# Altium project RFID_DACS-01.PrjPcb (part 1 of 3)
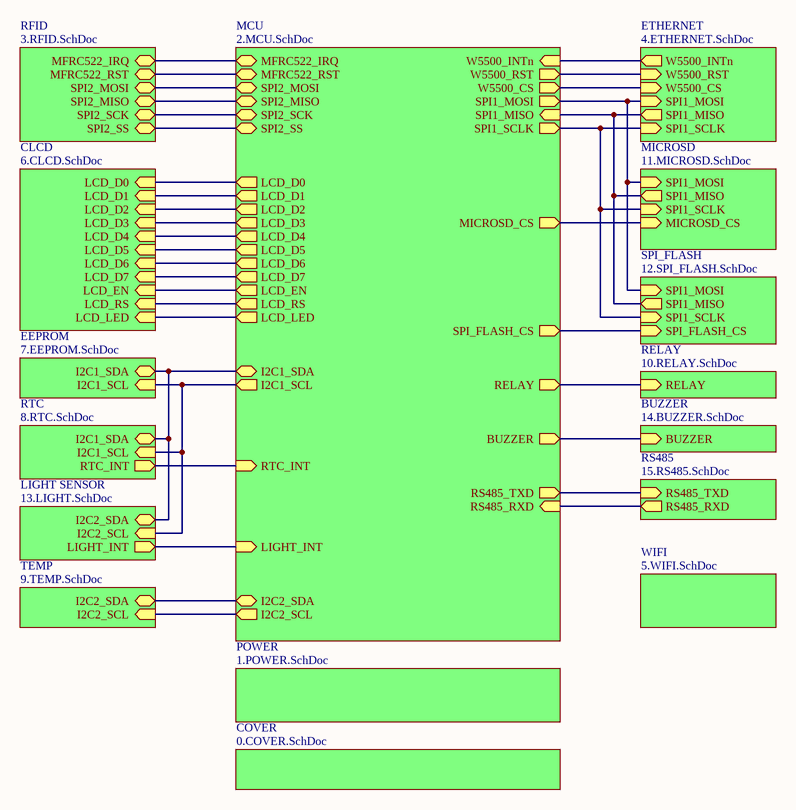
[diagram p0: RFID_DACS-01.SchDoc]
DesignedBy: AYTAC DILEK; Project: RFID_DACS-01; RevisionNumber: V1.0; TotalSheetNumber: 16; VersionRevision: V1I0
17 sheets, 190 parts. Net scope: hierarchical (ports join the sheet entries above them; power ports are global).
Board file: RFID_DACS-01.PcbDoc
Sheets:
  RFID_DACS-01.SchDoc
    MCU = 2.MCU.SchDoc
    ETHERNET = 4.ETHERNET.SchDoc
    RFID = 3.RFID.SchDoc
    MICROSD = 11.MICROSD.SchDoc
    SPI_FLASH = 12.SPI_FLASH.SchDoc
    CLCD = 6.CLCD.SchDoc
    EEPROM = 7.EEPROM.SchDoc
    RTC = 8.RTC.SchDoc
    TEMP = 9.TEMP.SchDoc
    POWER = 1.POWER.SchDoc
    RELAY = 10.RELAY.SchDoc
    BUZZER = 14.BUZZER.SchDoc
    RS485 = 15.RS485.SchDoc
    WIFI = 5.WIFI.SchDoc
    COVER = 0.COVER.SchDoc
    LIGHT SENSOR = 13.LIGHT.SchDoc

## Sheet RFID_DACS-01.SchDoc: BLOCK DIAGRAM
size A; DrawnBy: AYTAC DILEK

### Sub-sheets
BUZZER = 14.BUZZER.SchDoc: BUZZER (in)
CLCD = 6.CLCD.SchDoc: LCD_D0 (in), LCD_D1 (in), LCD_D2 (in), LCD_D3 (in), LCD_D5 (in), LCD_D4 (in), LCD_D6 (in), LCD_D7 (in), LCD_EN (in), LCD_RS (in), LCD_LED (in)
COVER = 0.COVER.SchDoc: no entries
EEPROM = 7.EEPROM.SchDoc: I2C1_SDA (bidir), I2C1_SCL (in)
ETHERNET = 4.ETHERNET.SchDoc: W5500_INTn (out), W5500_RST (in), W5500_CS (in), SPI1_MOSI (in), SPI1_MISO (out), SPI1_SCLK (in)
LIGHT SENSOR = 13.LIGHT.SchDoc: I2C2_SDA (bidir), I2C2_SCL (in), LIGHT_INT (out)
MCU = 2.MCU.SchDoc: W5500_INTn (in), W5500_RST (out), W5500_CS (out), SPI1_MOSI (out), SPI1_MISO (in), SPI1_SCLK (out), MFRC522_IRQ, MFRC522_RST, SPI2_MOSI, SPI2_MISO, SPI2_SCK, SPI2_SS, MICROSD_CS (out), SPI_FLASH_CS (out), LCD_D1 (out), LCD_D2 (out), LCD_D3 (out), LCD_D4 (out), LCD_D5 (out), LCD_D6 (out), LCD_D0 (out), LCD_D7 (out), LCD_EN (out), LCD_RS (out), LCD_LED (out), I2C1_SDA (bidir), I2C1_SCL (out), RTC_INT (in), I2C2_SDA (bidir), I2C2_SCL (out), RELAY (out), BUZZER (out), RS485_TXD (out), RS485_RXD (in), LIGHT_INT (in)
MICROSD = 11.MICROSD.SchDoc: SPI1_MOSI (in), SPI1_MISO (out), SPI1_SCLK (in), MICROSD_CS (in)
POWER = 1.POWER.SchDoc: no entries
RELAY = 10.RELAY.SchDoc: RELAY (in)
RFID = 3.RFID.SchDoc: MFRC522_IRQ, MFRC522_RST, SPI2_MOSI, SPI2_MISO, SPI2_SCK, SPI2_SS
RS485 = 15.RS485.SchDoc: RS485_TXD (in), RS485_RXD (out)
RTC = 8.RTC.SchDoc: I2C1_SDA (bidir), I2C1_SCL (in), RTC_INT (out)
SPI_FLASH = 12.SPI_FLASH.SchDoc: SPI1_MOSI (in), SPI1_MISO (out), SPI1_SCLK (in), SPI_FLASH_CS (in)
TEMP = 9.TEMP.SchDoc: I2C2_SDA (bidir), I2C2_SCL (in)
WIFI = 5.WIFI.SchDoc: no entries

### Nets
BUZZER: sheet MCU/BUZZER, sheet BUZZER/BUZZER
I2C1_SCL: sheet MCU/I2C1_SCL, sheet EEPROM/I2C1_SCL, sheet RTC/I2C1_SCL, sheet LIGHT SENSOR/I2C2_SCL
I2C1_SDA: sheet MCU/I2C1_SDA, sheet EEPROM/I2C1_SDA, sheet RTC/I2C1_SDA, sheet LIGHT SENSOR/I2C2_SDA
I2C2_SCL: sheet MCU/I2C2_SCL, sheet TEMP/I2C2_SCL
I2C2_SDA: sheet MCU/I2C2_SDA, sheet TEMP/I2C2_SDA
LCD_D0: sheet MCU/LCD_D0, sheet CLCD/LCD_D0
LCD_D1: sheet MCU/LCD_D1, sheet CLCD/LCD_D1
LCD_D2: sheet MCU/LCD_D2, sheet CLCD/LCD_D2
LCD_D3: sheet MCU/LCD_D3, sheet CLCD/LCD_D3
LCD_D4: sheet MCU/LCD_D4, sheet CLCD/LCD_D4
LCD_D5: sheet MCU/LCD_D5, sheet CLCD/LCD_D5
LCD_D6: sheet MCU/LCD_D6, sheet CLCD/LCD_D6
LCD_D7: sheet MCU/LCD_D7, sheet CLCD/LCD_D7
LCD_EN: sheet MCU/LCD_EN, sheet CLCD/LCD_EN
LCD_LED: sheet MCU/LCD_LED, sheet CLCD/LCD_LED
LCD_RS: sheet MCU/LCD_RS, sheet CLCD/LCD_RS
LIGHT_INT: sheet MCU/LIGHT_INT, sheet LIGHT SENSOR/LIGHT_INT
MFRC522_IRQ: sheet MCU/MFRC522_IRQ, sheet RFID/MFRC522_IRQ
MFRC522_RST: sheet MCU/MFRC522_RST, sheet RFID/MFRC522_RST
MICROSD_CS: sheet MCU/MICROSD_CS, sheet MICROSD/MICROSD_CS
RELAY: sheet MCU/RELAY, sheet RELAY/RELAY
RS485_RXD: sheet MCU/RS485_RXD, sheet RS485/RS485_RXD
RS485_TXD: sheet MCU/RS485_TXD, sheet RS485/RS485_TXD
RTC_INT: sheet MCU/RTC_INT, sheet RTC/RTC_INT
SPI1_MISO: sheet MCU/SPI1_MISO, sheet ETHERNET/SPI1_MISO, sheet MICROSD/SPI1_MISO, sheet SPI_FLASH/SPI1_MISO
SPI1_MOSI: sheet MCU/SPI1_MOSI, sheet ETHERNET/SPI1_MOSI, sheet MICROSD/SPI1_MOSI, sheet SPI_FLASH/SPI1_MOSI
SPI1_SCLK: sheet MCU/SPI1_SCLK, sheet ETHERNET/SPI1_SCLK, sheet MICROSD/SPI1_SCLK, sheet SPI_FLASH/SPI1_SCLK
SPI2_MISO: sheet MCU/SPI2_MISO, sheet RFID/SPI2_MISO
SPI2_MOSI: sheet MCU/SPI2_MOSI, sheet RFID/SPI2_MOSI
SPI2_SCK: sheet MCU/SPI2_SCK, sheet RFID/SPI2_SCK
SPI2_SS: sheet MCU/SPI2_SS, sheet RFID/SPI2_SS
SPI_FLASH_CS: sheet MCU/SPI_FLASH_CS, sheet SPI_FLASH/SPI_FLASH_CS
W5500_CS: sheet MCU/W5500_CS, sheet ETHERNET/W5500_CS
W5500_INTn: sheet MCU/W5500_INTn, sheet ETHERNET/W5500_INTn
W5500_RST: sheet MCU/W5500_RST, sheet ETHERNET/W5500_RST

## Sheet 2.MCU.SchDoc: MCU
size A3; DrawnBy: AYTAC DILEK; SheetNumber: 2; SheetTotal: 16
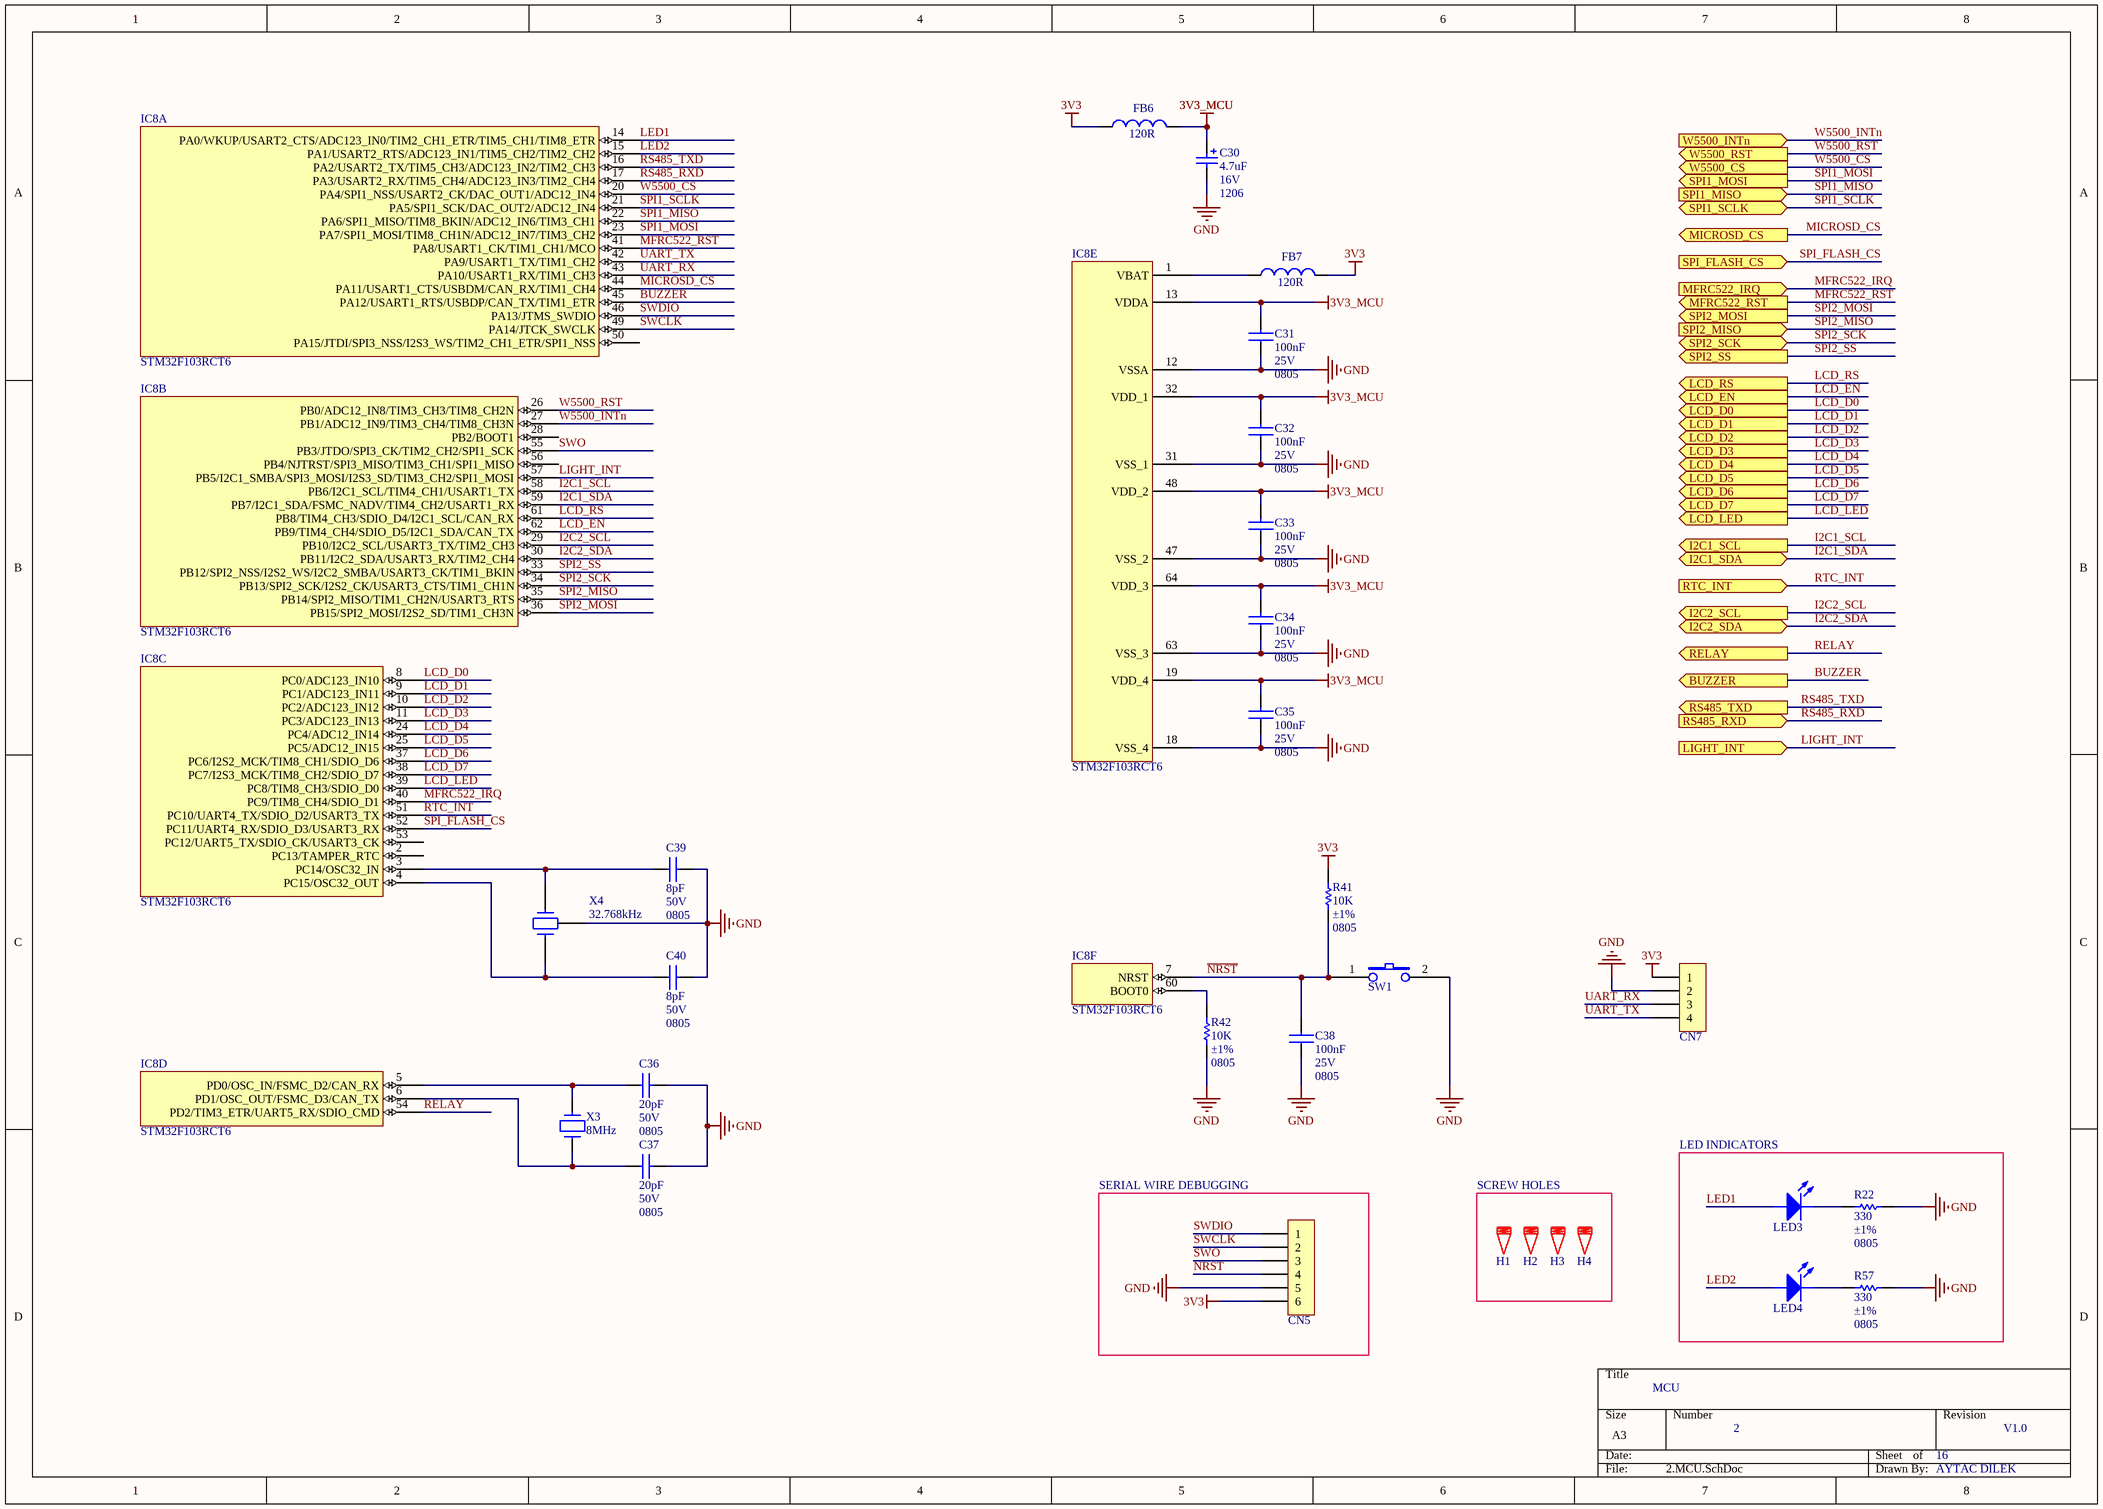
[diagram p1: 2.MCU.SchDoc]

### Parts
C30  value 4.7uF  Voltage - Rated: 16V  Package / Case: 1206  [CAPMP3216X16N_EIA-1206_CASE-A]  (hidden comment: CAP_P)
C31  Capacitance: 100nF  Voltage - Rated: 25V  Package / Case: 0805  [CAPC2012X100N_EIA0805]  (hidden comment: CAP_NP)
C32  Capacitance: 100nF  Voltage - Rated: 25V  Package / Case: 0805  [CAPC2012X100N_EIA0805]  (hidden comment: CAP_NP)
C33  Capacitance: 100nF  Voltage - Rated: 25V  Package / Case: 0805  [CAPC2012X100N_EIA0805]  (hidden comment: CAP_NP)
C34  Capacitance: 100nF  Voltage - Rated: 25V  Package / Case: 0805  [CAPC2012X100N_EIA0805]  (hidden comment: CAP_NP)
C35  Capacitance: 100nF  Voltage - Rated: 25V  Package / Case: 0805  [CAPC2012X100N_EIA0805]  (hidden comment: CAP_NP)
C36  Capacitance: 20pF  Voltage - Rated: 50V  Package / Case: 0805  [CAPC2012X100N_EIA0805]  (hidden comment: CAP_NP)
C37  Capacitance: 20pF  Voltage - Rated: 50V  Package / Case: 0805  [CAPC2012X100N_EIA0805]  (hidden comment: CAP_NP)
C38  Capacitance: 100nF  Voltage - Rated: 25V  Package / Case: 0805  [CAPC2012X100N_EIA0805]  (hidden comment: CAP_NP)
C39  Capacitance: 8pF  Voltage - Rated: 50V  Package / Case: 0805  [CAPC2012X100N_EIA0805]  (hidden comment: CAP_NP)
C40  Capacitance: 8pF  Voltage - Rated: 50V  Package / Case: 0805  [CAPC2012X100N_EIA0805]  (hidden comment: CAP_NP)
CN5  HDR_1X6  [HDRFV6W70P254_1X6_1524X254X1118P]  (value not drawn)
CN7  HDR_1X4  [HDRFV4W70P254_1X4_1016X254X1118P]  (value not drawn)
FB6  Impedance: 120R  [FILC2012X100N_EIA0805]  (hidden comment: BEAD)
FB7  Impedance: 120R  [FILC2012X100N_EIA0805]  (hidden comment: BEAD)
H1  HOLES  [HOLE_125MIL]  (value not drawn)
H2  HOLES  [HOLE_125MIL]  (value not drawn)
H3  HOLES  [HOLE_125MIL]  (value not drawn)
H4  HOLES  [HOLE_125MIL]  (value not drawn)
IC8  STM32F103RCT6  [QFP50P1200X1200X160-64N]  (parts A,B,C,D,E,F of 6)
LED3  LED  [LEDC2012X70N_EIA0805_RED]  (value not drawn)
LED4  LED  [LEDC2012X70N_EIA0805_RED]  (value not drawn)
R22  Resistance (Ohm): 330  Tolerance: ±1%  Package / Case: 0805  [RESC2013X65N_EIA0805]  (hidden comment: RES)
R41  Resistance (Ohm): 10K  Tolerance: ±1%  Package / Case: 0805  [RESC2013X65N_EIA0805]  (hidden comment: RES)
R42  Resistance (Ohm): 10K  Tolerance: ±1%  Package / Case: 0805  [RESC2013X65N_EIA0805]  (hidden comment: RES)
R57  Resistance (Ohm): 330  Tolerance: ±1%  Package / Case: 0805  [RESC2013X65N_EIA0805]  (hidden comment: RES)
SW1  SWITCH_TACTILE_2PIN  [[C&K]RS-282G05A3-SM_RT]  (value not drawn)
X3  value 8MHz  [HC-49/US]  (hidden comment: CRYSTAL)
X4  value 32.768kHz  [32.768_DIP]  (hidden comment: CRYSTAL_32K)

### Blocks framed on the sheet
SERIAL WIRE DEBUGGING: CN5
SCREW HOLES: H1-H4
LED INDICATORS: LED3 LED4 R22 R57

### Ports
BUZZER (out), I2C1_SCL (out), I2C1_SDA (bidir), I2C2_SCL (out), I2C2_SDA (bidir), LCD_D0 (out), LCD_D1 (out), LCD_D2 (out), LCD_D3 (out), LCD_D4 (out), LCD_D5 (out), LCD_D6 (out), LCD_D7 (out), LCD_EN (out), LCD_LED (out), LCD_RS (out), LIGHT_INT (in), MFRC522_IRQ (in), MFRC522_RST (out), MICROSD_CS (out), RELAY (out), RS485_RXD (in), RS485_TXD (out), RTC_INT (in), SPI1_MISO (in), SPI1_MOSI (out), SPI1_SCLK (bidir), SPI2_MISO (in), SPI2_MOSI (out), SPI2_SCK (bidir), SPI2_SS (out), SPI_FLASH_CS (in), W5500_CS (out), W5500_INTn (in), W5500_RST (out)

### Nets
3V3: CN5.6 CN7.1 FB6.1 FB7.2 R41.1
3V3_MCU: C30.1 C31.2 C32.2 C33.2 C34.2 C35.2 FB6.2 IC8.13(VDDA) IC8.19(VDD_4) IC8.32(VDD_1) IC8.48(VDD_2) IC8.64(VDD_3)
GND: C30.2 C31.1 C32.1 C33.1 C34.1 C35.1 C36.2 C37.2 C38.1 C39.2 C40.2 CN5.5 CN7.2 IC8.12(VSSA) IC8.18(VSS_4) IC8.31(VSS_1) IC8.47(VSS_2) IC8.63(VSS_3) R22.2 R42.2 R57.2 SW1.2(A1) X4.3
BUZZER: IC8.45(PA12/USART1_RTS/USBDP/CAN_TX/TIM1_ETR) ; port BUZZER
I2C1_SCL: IC8.58(PB6/I2C1_SCL/TIM4_CH1/USART1_TX) ; port I2C1_SCL
I2C1_SDA: IC8.59(PB7/I2C1_SDA/FSMC_NADV/TIM4_CH2/USART1_RX) ; port I2C1_SDA
I2C2_SCL: IC8.29(PB10/I2C2_SCL/USART3_TX/TIM2_CH3) ; port I2C2_SCL
I2C2_SDA: IC8.30(PB11/I2C2_SDA/USART3_RX/TIM2_CH4) ; port I2C2_SDA
LCD_D0: IC8.8(PC0/ADC123_IN10) ; port LCD_D0
LCD_D1: IC8.9(PC1/ADC123_IN11) ; port LCD_D1
LCD_D2: IC8.10(PC2/ADC123_IN12) ; port LCD_D2
LCD_D3: IC8.11(PC3/ADC123_IN13) ; port LCD_D3
LCD_D4: IC8.24(PC4/ADC12_IN14) ; port LCD_D4
LCD_D5: IC8.25(PC5/ADC12_IN15) ; port LCD_D5
LCD_D6: IC8.37(PC6/I2S2_MCK/TIM8_CH1/SDIO_D6) ; port LCD_D6
LCD_D7: IC8.38(PC7/I2S3_MCK/TIM8_CH2/SDIO_D7) ; port LCD_D7
LCD_EN: IC8.62(PB9/TIM4_CH4/SDIO_D5/I2C1_SDA/CAN_TX) ; port LCD_EN
LCD_LED: IC8.39(PC8/TIM8_CH3/SDIO_D0) ; port LCD_LED
LCD_RS: IC8.61(PB8/TIM4_CH3/SDIO_D4/I2C1_SCL/CAN_RX) ; port LCD_RS
LED1: IC8.14(PA0/WKUP/USART2_CTS/ADC123_IN0/TIM2_CH1_ETR/TIM5_CH1/TIM8_ETR) LED3.2
LED2: IC8.15(PA1/USART2_RTS/ADC123_IN1/TIM5_CH2/TIM2_CH2) LED4.2
LIGHT_INT: IC8.57(PB5/I2C1_SMBA/SPI3_MOSI/I2S3_SD/TIM3_CH2/SPI1_MOSI) ; port LIGHT_INT
MFRC522_IRQ: IC8.40(PC9/TIM8_CH4/SDIO_D1) ; port MFRC522_IRQ
MFRC522_RST: IC8.41(PA8/USART1_CK/TIM1_CH1/MCO) ; port MFRC522_RST
MICROSD_CS: IC8.44(PA11/USART1_CTS/USBDM/CAN_RX/TIM1_CH4) ; port MICROSD_CS
~{NRST}: C38.2 CN5.4 IC8.7(NRST) R41.2 SW1.1(A0)
RELAY: IC8.54(PD2/TIM3_ETR/UART5_RX/SDIO_CMD) ; port RELAY
RS485_RXD: IC8.17(PA3/USART2_RX/TIM5_CH4/ADC123_IN3/TIM2_CH4) ; port RS485_RXD
RS485_TXD: IC8.16(PA2/USART2_TX/TIM5_CH3/ADC123_IN2/TIM2_CH3) ; port RS485_TXD
RTC_INT: IC8.51(PC10/UART4_TX/SDIO_D2/USART3_TX) ; port RTC_INT
SPI1_MISO: IC8.22(PA6/SPI1_MISO/TIM8_BKIN/ADC12_IN6/TIM3_CH1) ; port SPI1_MISO
SPI1_MOSI: IC8.23(PA7/SPI1_MOSI/TIM8_CH1N/ADC12_IN7/TIM3_CH2) ; port SPI1_MOSI
SPI1_SCLK: IC8.21(PA5/SPI1_SCK/DAC_OUT2/ADC12_IN4) ; port SPI1_SCLK
SPI2_MISO: IC8.35(PB14/SPI2_MISO/TIM1_CH2N/USART3_RTS) ; port SPI2_MISO
SPI2_MOSI: IC8.36(PB15/SPI2_MOSI/I2S2_SD/TIM1_CH3N) ; port SPI2_MOSI
SPI2_SCK: IC8.34(PB13/SPI2_SCK/I2S2_CK/USART3_CTS/TIM1_CH1N) ; port SPI2_SCK
SPI2_SS: IC8.33(PB12/SPI2_NSS/I2S2_WS/I2C2_SMBA/USART3_CK/TIM1_BKIN) ; port SPI2_SS
SPI_FLASH_CS: IC8.52(PC11/UART4_RX/SDIO_D3/USART3_RX) ; port SPI_FLASH_CS
SWCLK: CN5.2 IC8.49(PA14/JTCK_SWCLK)
SWDIO: CN5.1 IC8.46(PA13/JTMS_SWDIO)
SWO: CN5.3 IC8.55(PB3/JTDO/SPI3_CK/TIM2_CH2/SPI1_SCK)
UART_RX: CN7.3 IC8.43(PA10/USART1_RX/TIM1_CH3)
UART_TX: CN7.4 IC8.42(PA9/USART1_TX/TIM1_CH2)
W5500_CS: IC8.20(PA4/SPI1_NSS/USART2_CK/DAC_OUT1/ADC12_IN4) ; port W5500_CS
W5500_INTn: IC8.27(PB1/ADC12_IN9/TIM3_CH4/TIM8_CH3N) ; port W5500_INTn
W5500_RST: IC8.26(PB0/ADC12_IN8/TIM3_CH3/TIM8_CH2N) ; port W5500_RST
NetC36_1: C36.1 IC8.5(PD0/OSC_IN/FSMC_D2/CAN_RX) X3.1
NetC37_1: C37.1 IC8.6(PD1/OSC_OUT/FSMC_D3/CAN_TX) X3.2
NetC39_1: C39.1 IC8.3(PC14/OSC32_IN) X4.2
NetC40_1: C40.1 IC8.4(PC15/OSC32_OUT) X4.1
NetFB7_1: FB7.1 IC8.1(VBAT)
NetIC8_60: IC8.60(BOOT0) R42.1
NetLED3_1: LED3.1 R22.1
NetLED4_1: LED4.1 R57.1

Not connected (* = marked no-connect by the designer): IC8 2(PC13/TAMPER_RTC) 28(PB2/BOOT1) 50(PA15/JTDI/SPI3_NSS/I2S3_WS/TIM2_CH1_ETR/SPI1_NSS) 53(PC12/UART5_TX/SDIO_CK/USART3_CK) 56(PB4/NJTRST/SPI3_MISO/TIM3_CH1/SPI1_MISO)

### Library data of the parts
C30 = SCAP01400003: CAP TANT 4.7UF 16V 10% 1206; Manufacturer: AVX Corporation; Manufacturer Part Number: TAJA475K016RNJ; Capacitance: 4.7µF; ESR (Equivalent Series Resistance): 4 Ohm; Type: Molded; Cost x1 ($): 0.56000; Cost x10 ($): 0.53600; Cost x100 ($): 0.26000; Cost x1000 ($): 0.18000; Distrubutor: Digikey; Part Number: SCAP01400003; Tolerance: ±10%; Operating Temperature: -55°C ~ 125°C; Category: Capacitors; Family: Tantalum Capacitors; Distributor Part Number: 478-3868-1-ND; Distributor Link: http://www.digikey.com/product-detail/en/TAJA475K016RNJ/478-3868-1-ND/1126914; ROHS: YES; Quantity: 20
C31-C35 C38 = SCAP00300093: CAP CER 0.1UF 25V X7R 0805; Manufacturer: Samsung Electro-Mechanics America, Inc.; Manufacturer Part Number: CL21B104KACNNNC; Value: 100nF; Tolerance: ±10%; Type: Multi Layer Ceramic Capacitor  (MLCC); Cost x1 ($): 0.10000; Cost x10 ($): 0.03300; Cost x100 ($): 0.01470; Cost x1000 ($): 0.00825; Distrubutor: Digikey; Lead Time: 11 Weeks; Part Number: SCAP00300093; Temperature Coefficient: X7R; Operating Temperature: -55°C ~ 125°C; Mounting Type: Surface Mount, MLCC; Size / Dimension: 0.079" L x 0.049" W (2.00mm x 1.25mm); Category: Capacitors; Family: Ceramic Capacitors; Distributor Part Number: 1276-1099-1-ND; Distributor Link: http://www.digikey.com/product-detail/en/samsung-electro-mechanics-america-inc/CL21B104KACNNNC/1276-1099-1-ND/3889185; ROHS: YES; Moisture Sensitivity Level (MSL): 1 (Unlimited); Quantity: 50
C36 C37 = SCAP00300041: CAP CER 20PF 50V NP0 0805; Manufacturer: Samsung Electro-Mechanics America, Inc.; Manufacturer Part Number: CL21C200JBANNNC; Tolerance: ±5%; Temperature Coefficient: C0G, NP0; Type: Multi Layer Ceramic Capacitor  (MLCC); Cost x1 ($): 0.10000; Cost x10 ($): 0.05400; Cost x100 ($): 0.02430; Cost x1000 ($): 0.01361; Distrubutor: Digikey; Lead Time: 11 Weeks; Part Number: SCAP00300041; Value: 20pF; Operating Temperature: -55°C ~ 125°C; Mounting Type: Surface Mount, MLCC; Size / Dimension: 0.079" L x 0.049" W (2.00mm x 1.25mm); Category: Capacitors; Family: Ceramic Capacitors; Distributor Part Number: 1276-1829-1-ND; Distributor Link: http://www.digikey.com/product-detail/en/samsung-electro-mechanics-america-inc/CL21C200JBANNNC/1276-1829-1-ND/3889915; ROHS: YES; Moisture Sensitivity Level (MSL): 1 (Unlimited); Quantity: 50
C39 C40 = SCAP00300030: CAP CER 8PF 50V NP0 0805; Manufacturer: Samsung Electro-Mechanics America, Inc.; Manufacturer Part Number: CL21C080CBANNNC; Tolerance: ±0.25pF; Temperature Coefficient: C0G, NP0; Type: Multi Layer Ceramic Capacitor  (MLCC); Cost x1 ($): 0.10000; Cost x10 ($): 0.01900; Cost x100 ($): 0.00860; Cost x1000 ($): 0.00481; Distrubutor: Digikey; Lead Time: 11 Weeks; Part Number: SCAP00300030; Value: 8pF; Operating Temperature: -55°C ~ 125°C; Mounting Type: Surface Mount, MLCC; Size / Dimension: 0.079" L x 0.049" W (2.00mm x 1.25mm); Category: Capacitors; Family: Ceramic Capacitors; Distributor Part Number: 1276-2556-1-ND; Distributor Link: http://www.digikey.com/product-detail/en/samsung-electro-mechanics-america-inc/CL21C080CBANNNC/1276-2556-1-ND/3890642; ROHS: YES; Moisture Sensitivity Level (MSL): 1 (Unlimited); Quantity: 50
CN5 = SCON00124: CONN ARDUINO HEADER .0100" 6POS; Manufacturer: Sparkfun; Manufacturer Part Number: PRT-09280; Pitch: 2.54mm; Connector Type: Stackable Header; Cost x1 ($): 0.50; Cost x100 ($): 0.48; Cost x1000 ($): 0.45; Part Number: SCON00124; Value: HDR_1X6; Category: Connectors, Interconnects; Family: Rectangular Connectors - Headers, Receptacles, Female Sockets; Contact Type: Female Socket; Mounting Type: Through Hole; Cost x10 ($): 0.50; Distrubutor: Sparkfun; Distributor Part Number: PRT-09280; Datasheet Link: https://www.sparkfun.com/products/9280; ROHS: YES; Quantity: 10
CN7 = SCON00140: CONN HEADER 4 POS 2.54; Manufacturer: Wurth Electronics Inc; Manufacturer Part Number: 61300411121; Pitch: 2.54mm; Connector Type: Header, Unshrouded; Cost x1 ($): 0.17000; Cost x100 ($): 0.15440; Cost x1000 ($): 0.13068; Distrubutor: Digikey; Lead Time: 15 Weeks; Part Number: SCON00140; Value: HDR_1X4; Category: Connectors, Interconnects; Family: Rectangular Connectors - Headers, Male Pins; Contact Type: Male Pin; Mounting Type: Through Hole; Cost x10 ($): 0.17000; Distributor Part Number: 732-5317-ND; Datasheet Link: http://www.digikey.com/product-detail/en/wurth-electronics-inc/61300411121/732-5317-ND/4846827; ROHS: YES; Moisture Sensitivity Level (MSL): 1 (Unlimited); Part Status: Active; Quantity: 0
FB6 FB7 = SFIL00005: FERRITE CHIP POWER 120 OHM SMD; Manufacturer: Laird-Signal Integrity Products; Manufacturer Part Number: HI0805O121R-10; Type: Differential Mode - Single; Current Rating: 3.5A; DC Resistance (DCR): 20 mOhm Max; Cost x10 ($): 0.08700; Cost x100 ($): 0.05230; Cost x1000 ($): 0.03010; Distrubutor: Digikey; Cost x1 ($): 0.10000; Part Number: SFIL00005; Package / Case: 0805 (2012 Metric); Value: BEAD; Category: Filters; Family: Ferrite Beads and Chips; Distributor Part Number: 240-2393-1-ND; ROHS: YES; Datasheet Link: http://www.digikey.com/product-detail/en/HI0805O121R-10/240-2393-1-ND/806753; Quantity: 50
H1-H4 = SMSC00005: Value: HOLE_125MIL; Part Number: SMSC00005
IC8 = SIC00045: IC MCU 32BIT 256KB FLASH 64LQFP; Manufacturer: STMicroelectronics; Vin: 2 V ~ 3.6 V; Protocol: CAN, I²C, IrDA, LIN, SPI, UART/USART, USB; Speed: 72MHz; Cost x10 ($): 7.04300; Cost x100 ($): 5.83130; Cost x1000 ($): 4.42260; Distrubutor: Digikey; Lead Time: 11 Weeks; Cost x1 ($): 7.80000; Part Number: SIC00045; Manufacturer Part Number: STM32F103RCT6; Value: STM32F103RCT6; Operating Temperature: -40°C ~ 85°C; Category: Integrated Circuits (ICs); Family: Embedded - Microcontrollers; Package / Case: 64-LQFP; Type: ARM® Cortex®-M3; Distributor Part Number: 497-9033-ND; ROHS: YES; Distributor Link: http://www.digikey.com/product-detail/en/STM32F103RCT6/497-9033-ND/2035353; MSL: 3 (168 Hours); Quantity: 0
LED3 LED4 = SOPT00004: LED SUPER RED CLR THIN 0805 SMD; Manufacturer: Lite-On Inc; Manufacturer Part Number: LTST-C171KRKT; Value: LED_RED; Cost x10 ($): 0.24800; Cost x100 ($): 0.13500; Cost x1000 ($): 0.05850; Distrubutor: Digikey; Cost x1 ($): 0.32000; Part Number: SOPT00004; Package / Case: 0805 (2012 Metric); Category: Optoelectronics; Family: LED Indication - Discrete; Type: LED; Distributor Part Number: 160-1427-1-ND; ROHS: YES; Datasheet Link: http://www.digikey.com/product-detail/en/LTST-C171KRKT/160-1427-1-ND/386800; Quantity: 110
R22 R57 = SRES03010062: RES SMD 330 OHM 1% 1/8W 0805; Manufacturer: Yageo; Manufacturer Part Number: RC0805FR-07330RL; Value: 330R; Power (Watts): 0.125W, 1/8W; Cost x1 ($): 0.10; Cost x10 ($): 0.21; Cost x100 ($): 0.84; Cost x1000 ($): 3.79; Distrubutor: Digikey; Part Number: SRES03010062; Category: Resistors; Family: Chip Resistor - Surface Mount; Distributor Part Number: 311-330CRCT-ND; Distributor Link: http://www.digikey.com/product-detail/en/RC0805FR-07330RL/311-330CRCT-ND/730813; ROHS: YES; Quantity: 0
R41 R42 = SRES03010098: RES SMD 10K OHM 1% 1/8W 0805; Manufacturer: Yageo; Manufacturer Part Number: RC0805FR-0710KL; Power (Watts): 0.125W, 1/8W; Cost x1 ($): 0.10; Cost x10 ($): 0.21; Cost x100 ($): 0.84; Cost x1000 ($): 3.79; Distrubutor: Digikey; Part Number: SRES03010098; Value: 10K; Category: Resistors; Family: Chip Resistor - Surface Mount; Distributor Part Number: 311-10.0KCRCT-ND; Distributor Link: http://www.digikey.com/product-detail/en/RC0805FR-0710KL/311-10.0KCRCT-ND/730482; ROHS: YES; Quantity: 0
SW1 = SSWI00022: SWITCH TACTILE SPST-NO 0.05A 12V; Manufacturer: C&K Components; Manufacturer Part Number: RS-282G05A3-SM RT; Value: SWITCH_TACTILE_MICRO_2PIN; Voltage: 12VDC; Current: 0.5A; Distrubutor: Digikey; Lead Time: 10 Weeks; Cost x10 ($): 0.72900; Cost x100 ($): 0.55000; Cost x1000 ($): 0.39875; Cost x1 ($): 0.76000; Part Number: SSWI00022; Package: SMD; Category: Switches; Family: Tactile Switches; Circuit: SPST-NO; Distributor Part Number: CKN10384CT-ND; Distrubutor Link: http://www.digikey.com/product-detail/en/c-k-components/RS-282G05A3-SM-RT/CKN10384CT-ND/2747203; ROHS: YES; Datasheet Link: 0; Moisture Sensitivity Level (MSL): 1 (Unlimited)
X3 = SCRY00001: CRYSTAL 8.0000MHZ 20PF T/H; Manufacturer: CTS-Frequency Controls; Manufacturer Part Number: ATS08A-E; Frequency Tolerance: ±20ppm; ESR: 60 Ohm; Cost x10 ($): 0.30000; Cost x100 ($): 0.24000; Cost x1000 ($): 0.19200; Distrubutor: Digikey; Lead Time: 9 Weeks; Cost x1 ($): 0.36000; Part Number: SCRY00001; Mounting Type: Through Hole; Load Capacitance: 20pF; Package / Case: HC49/US; Type: MHz Crystal; Distributor Part Number: CTX1054-ND; ROHS: YES; Datasheet Link: http://www.digikey.com/product-detail/en/ATS08A-E/CTX1054-ND/2640051; Quantity: 10
X4 = SCRY00009: CRYSTAL 32.768KHZ 6PF THRU; Manufacturer: Seiko Instruments; Manufacturer Part Number: VT200F-6PF20PPM; Frequency Tolerance: ±20ppm; ESR: 50 kOhm; Cost x10 ($): 0.25000; Cost x100 ($): 0.20000; Cost x1000 ($): 0.16000; Distrubutor: Digikey; Lead Time: 11 Weeks; Cost x1 ($): 0.30000; Part Number: SCRY00009; Mounting Type: Through Hole; Load Capacitance: 6pF; Package / Case: Cylindrical Can, Radial; Type: kHz Crystal (Tuning Fork); Distributor Part Number: 728-1000-ND; ROHS: YES; Datasheet Link: http://www.digikey.com/product-detail/en/VT200F-6PF20PPM/728-1000-ND/1626715; Quantity: 10

## Sheet 4.ETHERNET.SchDoc: ETHERNET
size A3; SheetNumber: 4; SheetTotal: 16
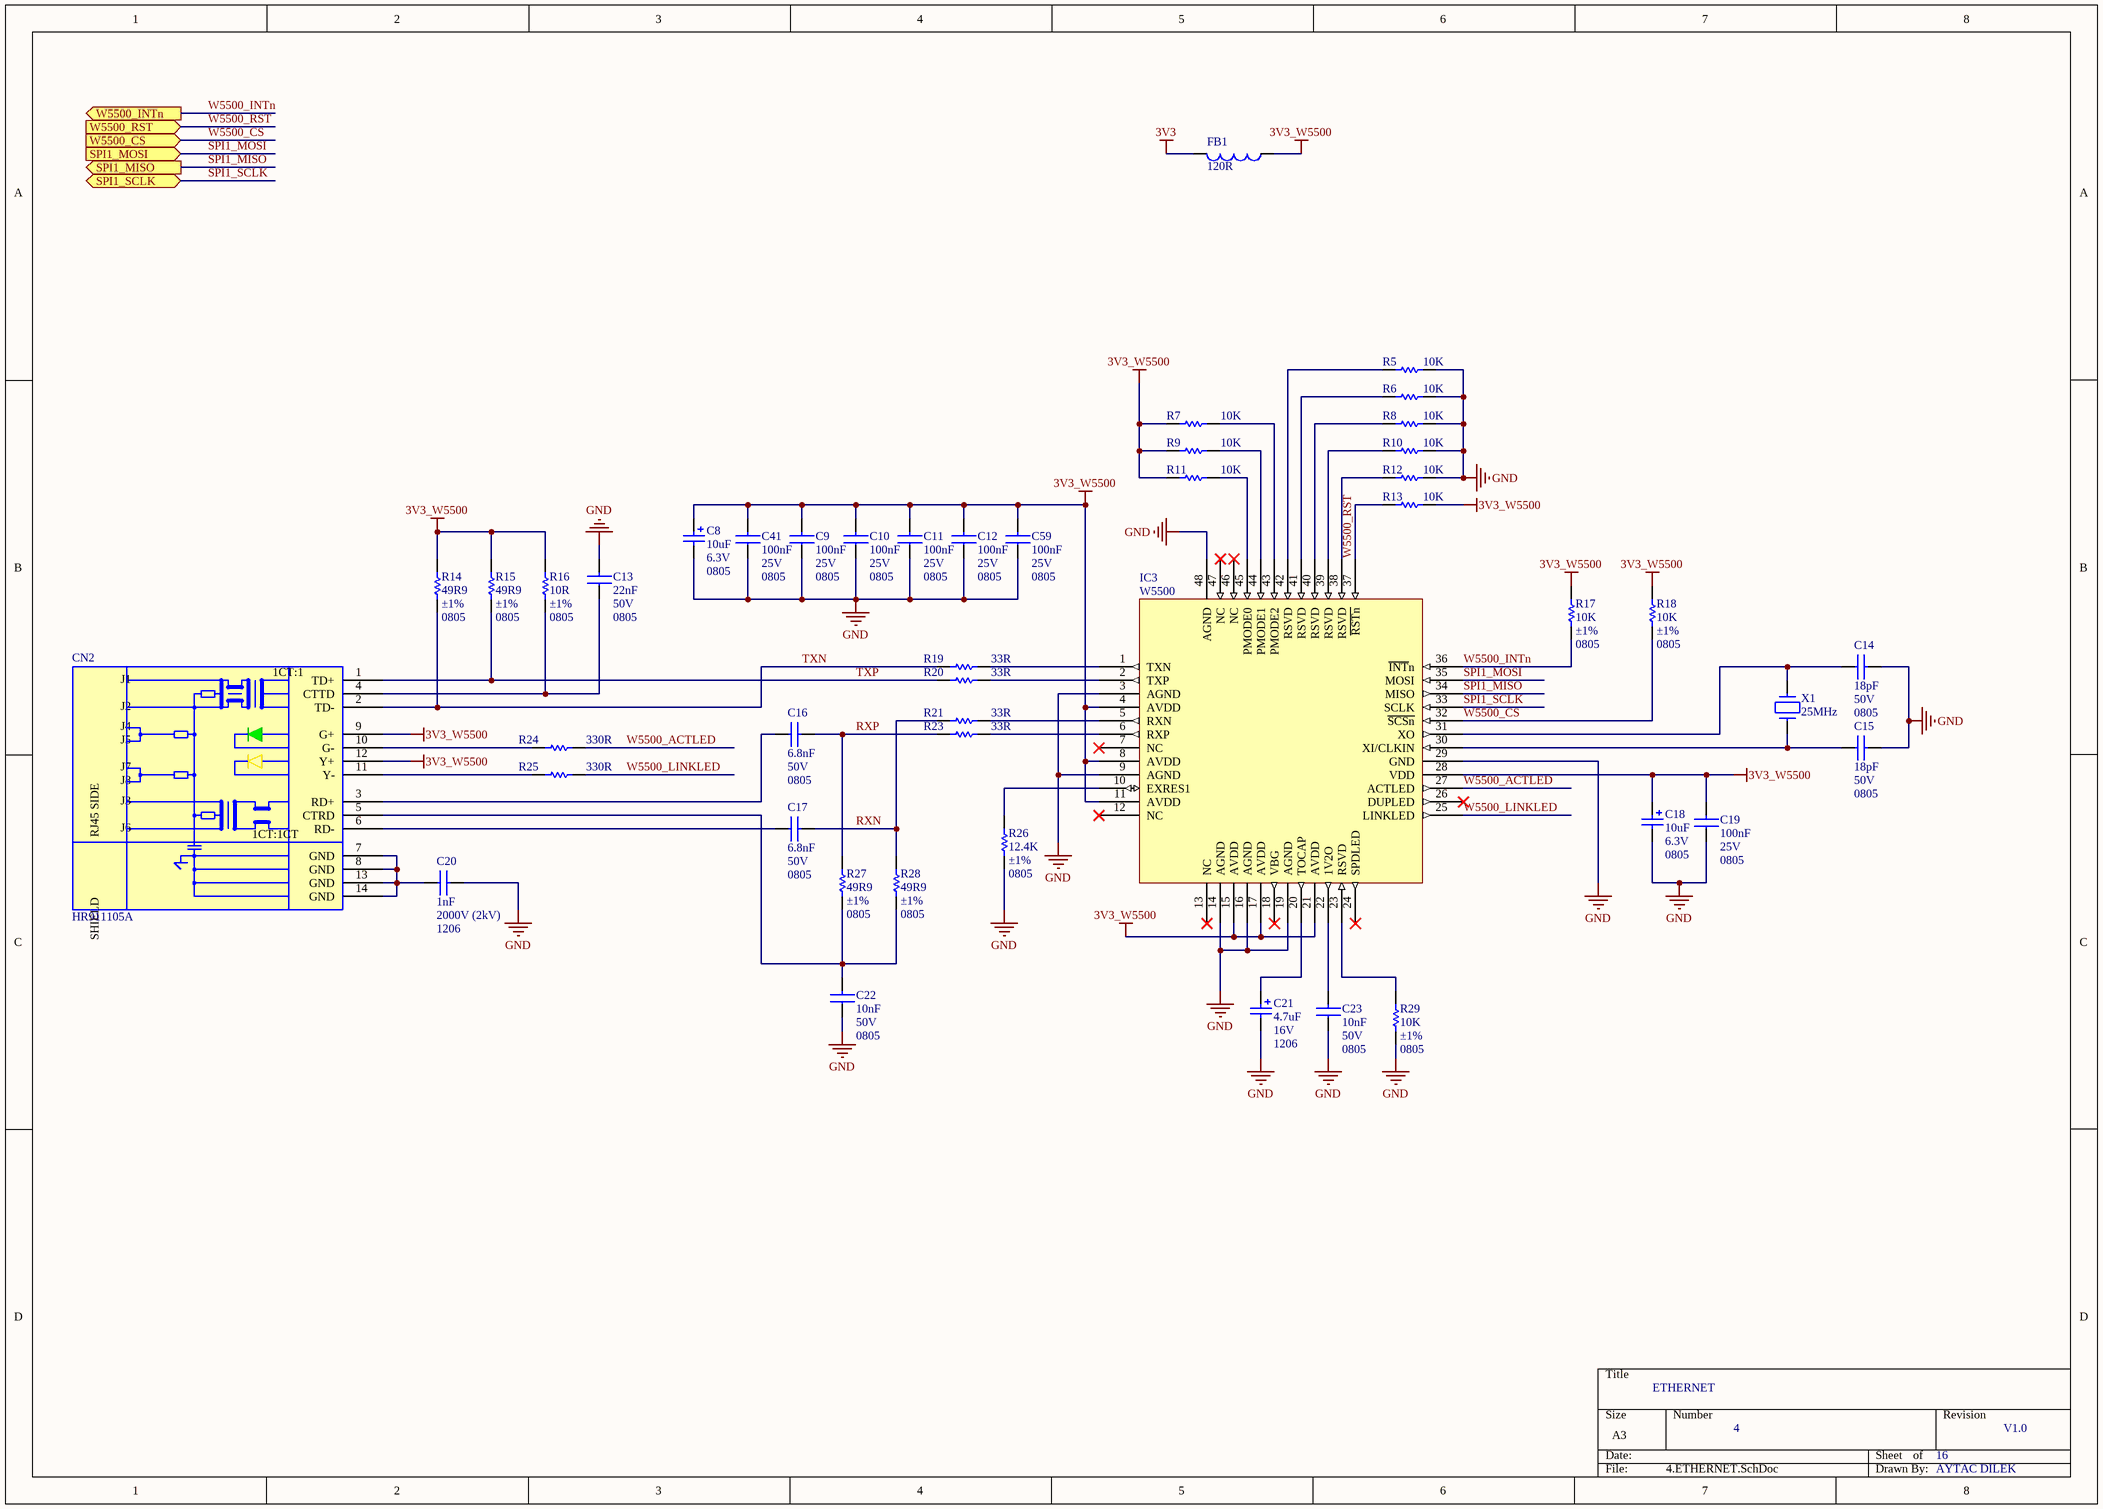
[diagram p2: 4.ETHERNET.SchDoc]

### Parts
C8  value 10uF  Voltage - Rated: 6.3V  Package / Case: 0805  [CAPMP2013X12N_EIA-0805_CASE-R]  (hidden comment: CAP_P)
C9  Capacitance: 100nF  Voltage - Rated: 25V  Package / Case: 0805  [CAPC2012X100N_EIA0805]  (hidden comment: CAP_NP)
C10  Capacitance: 100nF  Voltage - Rated: 25V  Package / Case: 0805  [CAPC2012X100N_EIA0805]  (hidden comment: CAP_NP)
C11  Capacitance: 100nF  Voltage - Rated: 25V  Package / Case: 0805  [CAPC2012X100N_EIA0805]  (hidden comment: CAP_NP)
C12  Capacitance: 100nF  Voltage - Rated: 25V  Package / Case: 0805  [CAPC2012X100N_EIA0805]  (hidden comment: CAP_NP)
C13  Capacitance: 22nF  Voltage - Rated: 50V  Package / Case: 0805  [CAPC2012X100N_EIA0805]  (hidden comment: CAP_NP)
C14  Capacitance: 18pF  Voltage - Rated: 50V  Package / Case: 0805  [CAPC2012X100N_EIA0805]  (hidden comment: CAP_NP)
C15  Capacitance: 18pF  Voltage - Rated: 50V  Package / Case: 0805  [CAPC2012X100N_EIA0805]  (hidden comment: CAP_NP)
C16  Capacitance: 6.8nF  Voltage - Rated: 50V  Package / Case: 0805  [CAPC2012X100N_EIA0805]  (hidden comment: CAP_NP)
C17  Capacitance: 6.8nF  Voltage - Rated: 50V  Package / Case: 0805  [CAPC2012X100N_EIA0805]  (hidden comment: CAP_NP)
C18  value 10uF  Voltage - Rated: 6.3V  Package / Case: 0805  [CAPMP2013X12N_EIA-0805_CASE-R]  (hidden comment: CAP_P)
C19  Capacitance: 100nF  Voltage - Rated: 25V  Package / Case: 0805  [CAPC2012X100N_EIA0805]  (hidden comment: CAP_NP)
C20  value 1nF  Voltage - Rated: 2000V (2kV)  Package / Case: 1206  [CAPC3216X125N_EIA1206]  (hidden comment: CAP_NP)
C21  value 4.7uF  Voltage - Rated: 16V  Package / Case: 1206  [CAPMP3216X16N_EIA-1206_CASE-A]  (hidden comment: CAP_P)
C22  Capacitance: 10nF  Voltage - Rated: 50V  Package / Case: 0805  [CAPC2012X100N_EIA0805]  (hidden comment: CAP_NP)
C23  Capacitance: 10nF  Voltage - Rated: 50V  Package / Case: 0805  [CAPC2012X100N_EIA0805]  (hidden comment: CAP_NP)
C41  Capacitance: 100nF  Voltage - Rated: 25V  Package / Case: 0805  [CAPC2012X100N_EIA0805]  (hidden comment: CAP_NP)
C59  Capacitance: 100nF  Voltage - Rated: 25V  Package / Case: 0805  [CAPC2012X100N_EIA0805]  (hidden comment: CAP_NP)
CN2  HR911105A  [HANRUN_HR911105A]
FB1  Impedance: 120R  [FILC2012X100N_EIA0805]  (hidden comment: BEAD)
IC3  W5500  [QFP50P900X900X160-48N]
R5  value 10K  [RESC2013X65N_EIA0805]  (hidden comment: RES)
R6  value 10K  [RESC2013X65N_EIA0805]  (hidden comment: RES)
R7  value 10K  [RESC2013X65N_EIA0805]  (hidden comment: RES)
R8  value 10K  [RESC2013X65N_EIA0805]  (hidden comment: RES)
R9  value 10K  [RESC2013X65N_EIA0805]  (hidden comment: RES)
R10  value 10K  [RESC2013X65N_EIA0805]  (hidden comment: RES)
R11  value 10K  [RESC2013X65N_EIA0805]  (hidden comment: RES)
R12  value 10K  [RESC2013X65N_EIA0805]  (hidden comment: RES)
R13  value 10K  [RESC2013X65N_EIA0805]  (hidden comment: RES)
R14  value 49R9  Tolerance: ±1%  Package / Case: 0805  [RESC2013X65N_EIA0805]  (hidden comment: RES)
R15  value 49R9  Tolerance: ±1%  Package / Case: 0805  [RESC2013X65N_EIA0805]  (hidden comment: RES)
R16  value 10R  Tolerance: ±1%  Package / Case: 0805  [RESC2013X65N_EIA0805]  (hidden comment: RES)
R17  value 10K  Tolerance: ±1%  Package / Case: 0805  [RESC2013X65N_EIA0805]  (hidden comment: RES)
R18  value 10K  Tolerance: ±1%  Package / Case: 0805  [RESC2013X65N_EIA0805]  (hidden comment: RES)
R19  value 33R  [RESC2013X65N_EIA0805]  (hidden comment: RES)
R20  value 33R  [RESC2013X65N_EIA0805]  (hidden comment: RES)
R21  value 33R  [RESC2013X65N_EIA0805]  (hidden comment: RES)
R23  value 33R  [RESC2013X65N_EIA0805]  (hidden comment: RES)
R24  value 330R  [RESC2013X65N_EIA0805]  (hidden comment: RES)
R25  value 330R  [RESC2013X65N_EIA0805]  (hidden comment: RES)
R26  value 12.4K  Tolerance: ±1%  Package / Case: 0805  [RESC2013X65N_EIA0805]  (hidden comment: RES)
R27  value 49R9  Tolerance: ±1%  Package / Case: 0805  [RESC2013X65N_EIA0805]  (hidden comment: RES)
R28  value 49R9  Tolerance: ±1%  Package / Case: 0805  [RESC2013X65N_EIA0805]  (hidden comment: RES)
R29  value 10K  Tolerance: ±1%  Package / Case: 0805  [RESC2013X65N_EIA0805]  (hidden comment: RES)
X1  value 25MHz  [HC-49/US]  (hidden comment: CRYSTAL)

### Ports
SPI1_MISO (out), SPI1_MOSI (in), SPI1_SCLK (bidir), W5500_CS (in), W5500_INTn (out), W5500_RST (in)

### Nets
3V3: FB1.2
3V3_W5500: C8.1 C9.2 C10.2 C11.2 C12.2 C18.1 C19.2 C41.2 C59.2 CN2.9(G+) CN2.12(Y+) FB1.1 IC3.4(AVDD) IC3.8(AVDD) IC3.11(AVDD) IC3.15(AVDD) IC3.17(AVDD) IC3.21(AVDD) IC3.28(VDD) R7.2 R9.2 R11.2 R13.2 R14.1 R15.1 R16.1 R17.1 R18.1
GND: C8.2 C9.1 C10.1 C11.1 C12.1 C13.2 C14.2 C15.2 C18.2 C19.1 C20.2 C21.2 C22.1 C23.1 C41.1 C59.1 IC3.3(AGND) IC3.9(AGND) IC3.14(AGND) IC3.16(AGND) IC3.19(AGND) IC3.29(GND) IC3.48(AGND) R5.2 R6.2 R8.2 R10.2 R12.2 R26.2 R29.2
RXN: C17.2 R21.2 R28.1
RXP: C16.2 R23.2 R27.1
SPI1_MISO: IC3.34(MISO) ; port SPI1_MISO
SPI1_MOSI: IC3.35(MOSI) ; port SPI1_MOSI
SPI1_SCLK: IC3.33(SCLK) ; port SPI1_SCLK
TXN: CN2.2(TD-) R14.2 R19.2
TXP: CN2.1(TD+) R15.2 R20.2
W5500_ACTLED: IC3.27(ACTLED) R24.1
W5500_CS: IC3.32(~{SCSn}) R18.2 ; port W5500_CS
W5500_INTn: IC3.36(~{INT}n) R17.2 ; port W5500_INTn
W5500_LINKLED: IC3.25(LINKLED) R25.1
W5500_RST: IC3.37(~{RSTn}) R13.1 ; port W5500_RST
NetC13_1: C13.1 CN2.4(CTTD) R16.2
NetC14_1: C14.1 IC3.31(XO) X1.1
NetC15_1: C15.1 IC3.30(XI/CLKIN) X1.2
NetC16_1: C16.1 CN2.3(RD+)
NetC17_1: C17.1 CN2.6(RD-)
NetC20_1: C20.1 CN2.7(GND) CN2.8(GND) CN2.13(GND) CN2.14(GND)
NetC21_1: C21.1 IC3.20(TOCAP)
NetC22_2: C22.2 CN2.5(CTRD) R27.2 R28.2
NetC23_2: C23.2 IC3.22(1V2O)
NetCN2_10: CN2.10(G-) R24.2
NetCN2_11: CN2.11(Y-) R25.2
NetIC3_1: IC3.1(TXN) R19.1
NetIC3_2: IC3.2(TXP) R20.1
NetIC3_5: IC3.5(RXN) R21.1
NetIC3_6: IC3.6(RXP) R23.1
NetIC3_10: IC3.10(EXRES1) R26.1
NetIC3_23: IC3.23(RSVD) R29.1
NetIC3_38: IC3.38(RSVD) R12.1
NetIC3_39: IC3.39(RSVD) R10.1
NetIC3_40: IC3.40(RSVD) R8.1
NetIC3_41: IC3.41(RSVD) R6.1
NetIC3_42: IC3.42(RSVD) R5.1
NetIC3_43: IC3.43(PMODE2) R7.1
NetIC3_44: IC3.44(PMODE1) R9.1
NetIC3_45: IC3.45(PMODE0) R11.1

Not connected (* = marked no-connect by the designer): IC3 7(NC)* 12(NC)* 13(NC)* 18(VBG)* 24(SPDLED)* 26(DUPLED)* 46(NC)* 47(NC)*

### Notes on the sheet
- (in symbol SCON00127) 1CT:1; J1; J2; J4; J5; J7; RJ45 SIDE; J8; J3; J6; 1CT:1CT; SHIELD

### Library data of the parts
C8 C18 = SCAP01400004: CAP TANT 10UF 6.3V 10% 0805; Manufacturer: AVX Corporation; Manufacturer Part Number: TPSP106K006R1500; Capacitance: 10µF; ESR (Equivalent Series Resistance): 6 Ohm; Type: Molded; Cost x1 ($): 0.83; Cost x10 ($): 0.79600; Cost x100 ($): 0.38610; Cost x1000 ($): 0.26730; Distrubutor: Digikey; Part Number: SCAP01400004; Tolerance: ±10%; Operating Temperature: -55°C ~ 125°C; Category: Capacitors; Family: Tantalum Capacitors; Distributor Part Number: 478-9266-1-ND; Distributor Link: http://www.digikey.com/product-detail/en/TPSR106K006R1500/478-9266-1-ND/4562131; ROHS: YES; Quantity: 20
C9-C12 C19 C41 C59 = SCAP00300093: as C31 on sheet 2.MCU; Part Number: SCAP00300093; Temperature Coefficient: X7R; Operating Temperature: -55°C ~ 125°C; Mounting Type: Surface Mount, MLCC; Size / Dimension: 0.079" L x 0.049" W (2.00mm x 1.25mm); Category: Capacitors; Family: Ceramic Capacitors; Distributor Part Number: 1276-1099-1-ND; Distributor Link: http://www.digikey.com/product-detail/en/samsung-electro-mechanics-america-inc/CL21B104KACNNNC/1276-1099-1-ND/3889185; ROHS: YES; Moisture Sensitivity Level (MSL): 1 (Unlimited); Quantity: 50
C13 = SCAP00300087: CAP CER 0.022UF 50V X7R 0805; Manufacturer: Samsung Electro-Mechanics America, Inc.; Manufacturer Part Number: CL21B223KBANNNC; Value: 22nF; Tolerance: ±10%; Type: Multi Layer Ceramic Capacitor  (MLCC); Cost x1 ($): 0.10000; Cost x10 ($): 0.05800; Cost x100 ($): 0.02600; Cost x1000 ($): 0.01458; Distrubutor: Digikey; Lead Time: 11 Weeks; Part Number: SCAP00300087; Temperature Coefficient: X7R; Operating Temperature: -55°C ~ 125°C; Mounting Type: Surface Mount, MLCC; Size / Dimension: 0.079" L x 0.049" W (2.00mm x 1.25mm); Category: Capacitors; Family: Ceramic Capacitors; Distributor Part Number: 1276-1081-1-ND; Distributor Link: http://www.digikey.com/product-detail/en/samsung-electro-mechanics-america-inc/CL21B223KBANNNC/1276-1081-1-ND/3889167; ROHS: YES; Moisture Sensitivity Level (MSL): 1 (Unlimited); Quantity: 50
C14 C15 = SCAP00300040: CAP CER 18PF 50V NP0 0805; Manufacturer: Samsung Electro-Mechanics America, Inc.; Manufacturer Part Number: CL21C180JBANNNC; Tolerance: ±5%; Temperature Coefficient: C0G, NP0; Type: Multi Layer Ceramic Capacitor  (MLCC); Cost x1 ($): 0.10000; Cost x10 ($): 0.04400; Cost x100 ($): 0.01960; Cost x1000 ($): 0.01100; Distrubutor: Digikey; Lead Time: 11 Weeks; Part Number: SCAP00300040; Value: 18pF; Operating Temperature: -55°C ~ 125°C; Mounting Type: Surface Mount, MLCC; Size / Dimension: 0.079" L x 0.049" W (2.00mm x 1.25mm); Category: Capacitors; Family: Ceramic Capacitors; Distributor Part Number: 1276-1107-1-ND; Distributor Link: http://www.digikey.com/product-detail/en/samsung-electro-mechanics-america-inc/CL21C180JBANNNC/1276-1107-1-ND/3889193; ROHS: YES; Moisture Sensitivity Level (MSL): 1 (Unlimited); Quantity: 50
C16 C17 = SCAP00300083: CAP CER 6800PF 50V X7R 0805; Manufacturer: Samsung Electro-Mechanics America, Inc.; Manufacturer Part Number: CL21B682KBANNNC; Value: 6.8nF; Tolerance: ±10%; Type: Multi Layer Ceramic Capacitor  (MLCC); Cost x1 ($): 0.10000; Cost x10 ($): 0.05100; Cost x100 ($): 0.02280; Cost x1000 ($): 0.01279; Distrubutor: Digikey; Lead Time: 11 Weeks; Part Number: SCAP00300083; Temperature Coefficient: X7R; Operating Temperature: -55°C ~ 125°C; Mounting Type: Surface Mount, MLCC; Size / Dimension: 0.079" L x 0.049" W (2.00mm x 1.25mm); Category: Capacitors; Family: Ceramic Capacitors; Distributor Part Number: 1276-1799-1-ND; Distributor Link: http://www.digikey.com/product-detail/en/samsung-electro-mechanics-america-inc/CL21B682KBANNNC/1276-1799-1-ND/3889885; ROHS: YES; Moisture Sensitivity Level (MSL): 1 (Unlimited); Quantity: 50
C20 = SCAP00410036: CAP CER 1000PF 2KV X7R 1206; Manufacturer: Johanson Dielectrics Inc.; Manufacturer Part Number: 202R18W102KV4E; Tolerance: ±10%; Type: Multi Layer Ceramic Capacitor  (MLCC); Cost x1 ($): 0.12000; Cost x10 ($): 0.08600; Cost x100 ($): 0.04070; Cost x1000 ($): 0.02361; Distrubutor: Digikey; Lead Time: 8 Weeks; Part Number: SCAP00410036; Capacitance: 1000pF; Temperature Coefficient: X7R; Operating Temperature: -55°C ~ 125°C; Mounting Type: Surface Mount, MLCC; Size / Dimension: 0.125" L x 0.062" W (3.17mm x 1.57mm); Category: Capacitors; Family: Ceramic Capacitors; Distributor Part Number: 709-1036-1-ND; Distributor Link: http://www.digikey.com/product-detail/en/johanson-dielectrics-inc/202R18W102KV4E/709-1036-1-ND/1556441; ROHS: YES; Moisture Sensitivity Level (MSL): 1 (Unlimited); Quantity: 0
C21 = SCAP01400003: as C30 on sheet 2.MCU; Part Number: SCAP01400003; Tolerance: ±10%; Operating Temperature: -55°C ~ 125°C; Category: Capacitors; Family: Tantalum Capacitors; Distributor Part Number: 478-3868-1-ND; Distributor Link: http://www.digikey.com/product-detail/en/TAJA475K016RNJ/478-3868-1-ND/1126914; ROHS: YES; Quantity: 20
C22 C23 = SCAP00300085: CAP CER 10000PF 50V X7R 0805; Manufacturer: Samsung Electro-Mechanics America, Inc.; Manufacturer Part Number: CL21B103KBANNNC; Value: 10nF; Tolerance: ±10%; Type: Multi Layer Ceramic Capacitor  (MLCC); Cost x1 ($): 0.10000; Cost x10 ($): 0.02700; Cost x100 ($): 0.01210; Cost x1000 ($): 0.00677; Distrubutor: Digikey; Lead Time: 11 Weeks; Part Number: SCAP00300085; Temperature Coefficient: X7R; Operating Temperature: -55°C ~ 125°C; Mounting Type: Surface Mount, MLCC; Size / Dimension: 0.079" L x 0.049" W (2.00mm x 1.25mm); Category: Capacitors; Family: Ceramic Capacitors; Distributor Part Number: 1276-1015-1-ND; Distributor Link: http://www.digikey.com/product-detail/en/samsung-electro-mechanics-america-inc/CL21B103KBANNNC/1276-1015-1-ND/3889101; ROHS: YES; Moisture Sensitivity Level (MSL): 1 (Unlimited); Quantity: 50
CN2 = SCON00127: CONN MAGJACK 1PORT 100 BASE-T; Connector Type: RJ45; Distrubutor: Digikey; Part Number: SCON00127; Value: HR911105A; Category: Connectors, Interconnects; Family: Modular Connectors - Jacks With Magnetics; Mounting Type: Through Hole; Quantity: 10
FB1 = SFIL00005: as FB6 on sheet 2.MCU; Part Number: SFIL00005; Package / Case: 0805 (2012 Metric); Value: BEAD; Category: Filters; Family: Ferrite Beads and Chips; Distributor Part Number: 240-2393-1-ND; ROHS: YES; Datasheet Link: http://www.digikey.com/product-detail/en/HI0805O121R-10/240-2393-1-ND/806753; Quantity: 50
IC3 = SIC00138: IC CTLR 3-1 ETH TCP/IP 48LQFP; Manufacturer: WIZnet; Vin: 2.97 V ~ 3.63 V; Protocol: SPI; Iin: 132mA; Cost x10 ($): 3.72500; Cost x100 ($): 3.05450; Cost x1000 ($): 2.08600; Distrubutor: Digikey; Lead Time: 8 Weeks; Cost x1 ($): 4.17000; Part Number: SIC00138; Manufacturer Part Number: W5500; Value: W5500; Operating Temperature: -40°C ~ 85°C; Category: Integrated Circuits (ICs); Family: Interface - Controllers; Package / Case: 48-LQFP (7x7); Type: Ethernet; Distributor Part Number: 1278-1021-ND; ROHS: YES; Distributor Link: http://www.digikey.com/product-detail/en/wiznet/W5500/1278-1021-ND/4425702; MSL: 3 (168 Hours); Quantity: 0
R5-R13 R17 R18 R29 = SRES03010098: as R41 on sheet 2.MCU; Part Number: SRES03010098; Resistance (Ohm): 10K; Category: Resistors; Family: Chip Resistor - Surface Mount; Distributor Part Number: 311-10.0KCRCT-ND; Distributor Link: http://www.digikey.com/product-detail/en/RC0805FR-0710KL/311-10.0KCRCT-ND/730482; ROHS: YES; Quantity: 0
  R5-R13: Tolerance: ±1%; Package / Case: 0805
R14 R15 R27 R28 = SRES03030081: RES SMD 49.9 OHM 1% 1/8W 0805; Manufacturer: Samsung Electro-Mechanics America, Inc.; Manufacturer Part Number: RC2012F49R9CS; Resistance (Ohm): 49.9; Power (Watts): 0.125W, 1/8W; Cost x1 ($): 0.10000; Cost x10 ($): 0.02200; Cost x100 ($): 0.00910; Cost x1000 ($): 0.00408; Distrubutor: Digikey; Part Number: SRES03030081; Category: Resistors; Family: Chip Resistor - Surface Mount; Distributor Part Number: 1276-5210-1-ND; Distributor Link: http://www.digikey.com/product-detail/en/samsung-electro-mechanics-america-inc/RC2012F49R9CS/1276-5210-1-ND/3968182; ROHS: YES; Quantity: 0
R16 = SRES03010026: RES SMD 10 OHM 1% 1/8W 0805; Manufacturer: Yageo; Manufacturer Part Number: RC0805FR-0710RL; Resistance (Ohm): 10; Power (Watts): 0.125W, 1/8W; Cost x1 ($): 0.10; Cost x10 ($): 0.21; Cost x100 ($): 0.84; Cost x1000 ($): 3.79; Distrubutor: Digikey; Part Number: SRES03010026; Category: Resistors; Family: Chip Resistor - Surface Mount; Distributor Part Number: 311-10.0CRCT-ND; Distributor Link: http://www.digikey.com/product-detail/en/RC0805FR-0710RL/311-10.0CRCT-ND/730481; ROHS: YES; Quantity: 0
R19-R21 R23 = SRES03010038: RES SMD 33 OHM 1% 1/8W 0805; Manufacturer: Yageo; Manufacturer Part Number: RC0805FR-0733RL; Resistance (Ohm): 33; Power (Watts): 0.125W, 1/8W; Cost x1 ($): 0.10; Cost x10 ($): 0.21; Cost x100 ($): 0.84; Cost x1000 ($): 3.79; Distrubutor: Digikey; Part Number: SRES03010038; Tolerance: ±1%; Package / Case: 0805; Category: Resistors; Family: Chip Resistor - Surface Mount; Distributor Part Number: 311-33.0CRCT-ND; Distributor Link: http://www.digikey.com/product-detail/en/RC0805FR-0733RL/311-33.0CRCT-ND/730809; ROHS: YES; Quantity: 0
R24 R25 = SRES03010062: RES SMD 330 OHM 1% 1/8W 0805; Manufacturer: Yageo; Manufacturer Part Number: RC0805FR-07330RL; Resistance (Ohm): 330; Power (Watts): 0.125W, 1/8W; Cost x1 ($): 0.10; Cost x10 ($): 0.21; Cost x100 ($): 0.84; Cost x1000 ($): 3.79; Distrubutor: Digikey; Part Number: SRES03010062; Tolerance: ±1%; Package / Case: 0805; Category: Resistors; Family: Chip Resistor - Surface Mount; Distributor Part Number: 311-330CRCT-ND; Distributor Link: http://www.digikey.com/product-detail/en/RC0805FR-07330RL/311-330CRCT-ND/730813; ROHS: YES; Quantity: 0
R26 = SRES03010171: RES SMD 12.4K OHM 1% 1/8W 0805; Manufacturer: Yageo; Manufacturer Part Number: RC0805FR-0712K4L; Power (Watts): 0.125W, 1/8W; Cost x1 ($): 0.10000; Cost x10 ($): 0.02100; Cost x100 ($): 0.00840; Cost x1000 ($): 0.00379; Distrubutor: Digikey; Lead Time: 22 Weeks; Part Number: SRES03010171; Resistance (Ohm): 12.4K; Category: Resistors; Family: Chip Resistor - Surface Mount; Distributor Part Number: 311-12.4KCRCT-ND; Distributor Link: http://www.digikey.com/product-detail/en/yageo/RC0805FR-0712K4L/311-12.4KCRCT-ND/730519; ROHS: YES; Moisture Sensitivity Level (MSL): 1 (Unlimited); Quantity: 0
X1 = SCRY00016: CRYSTAL 25.0000MHZ 18PF T/H; Manufacturer: CTS-Frequency Controls; Manufacturer Part Number: ATS250B-E; Frequency Tolerance: ±30ppm; ESR: 30 Ohm; Cost x10 ($): 0.30000; Cost x100 ($): 0.24000; Cost x1000 ($): 0.19200; Distrubutor: Digikey; Lead Time: 6 Weeks; Cost x1 ($): 0.36000; Part Number: SCRY00016; Mounting Type: Through Hole; Load Capacitance: 18pF; Package / Case: HC49/US; Type: MHz Crystal; Distributor Part Number: CTX928-ND; ROHS: YES; Datasheet Link: http://www.digikey.com/product-detail/en/cts-frequency-controls/ATS250B-E/CTX928-ND/2292924; Quantity: 20